# Altium schematic sheet ESP32.SchDoc
size 279 x 215 mm; SheetNumber: 2; SheetTotal: 4
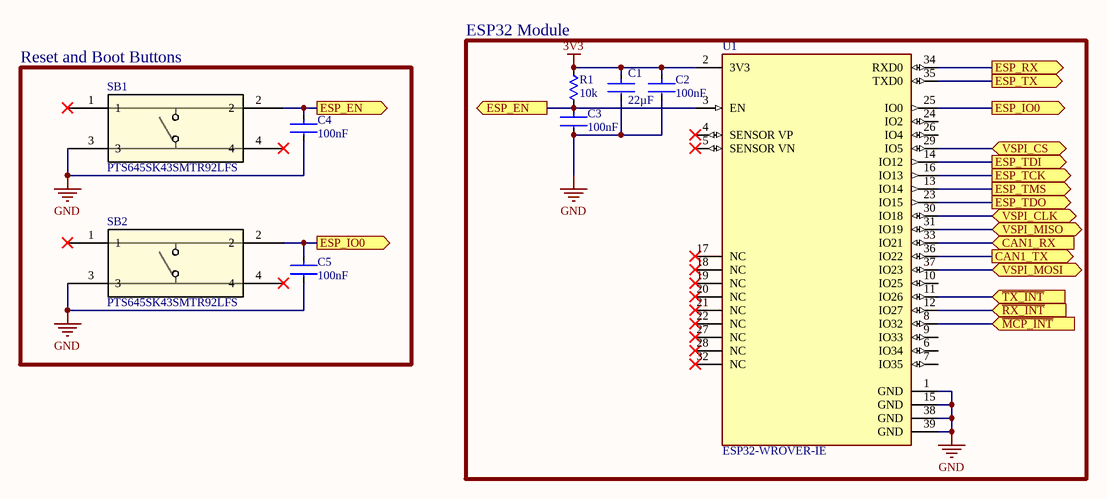
[diagram p0: ESP32.SchDoc]

## Parts
C1  value 22µF  [CL32A226KAJNNNE-Footprint-1]  (hidden comment: CL32A226KAJNNNE)
C2  value 100nF  [FP-CL10-IPC_B]  (hidden comment: CL10B104KB8WPNC)
C3  value 100nF  [FP-CL10-IPC_B]  (hidden comment: CL10B104KB8WPNC)
C4  value 100nF  [FP-CL10-IPC_B]  (hidden comment: CL10B104KB8WPNC)
C5  value 100nF  [FP-CL10-IPC_B]  (hidden comment: CL10B104KB8WPNC)
R1  value 10k  [FP-CRCW0603-e3-IPC_B]  (hidden comment: CRCW060310K0FKEA)
SB1  PTS645SK43SMTR92LFS  [PTS645SK43SMTR92LFS-Footprint-1]
SB2  PTS645SK43SMTR92LFS  [PTS645SK43SMTR92LFS-Footprint-1]
U1  ESP32-WROVER-IE  [FP-ESP32-WROVER-IE_M213EH-MFG]

## Blocks framed on the sheet
ESP32 Module: C1-C3 R1 U1
Reset and Boot Buttons: C4 C5 SB1 SB2

## Ports
CAN1_RX (in, see Telemetry_Module[4B], CAN_Controller[4A]), CAN1_TX (out, see Telemetry_Module[4B], CAN_Controller[4A]), ESP_EN (out, see Telemetry_Module[3C], FTDI_USB[5C]), ESP_IO0 (out, see Telemetry_Module[3C], FTDI_USB[5C]), ESP_RX (out, see Telemetry_Module[3B], FTDI_USB[4C]), ESP_TCK (out, see Telemetry_Module[3B], FTDI_USB[6D]), ESP_TDI (out, see Telemetry_Module[3B], FTDI_USB[6D]), ESP_TDO (out, see Telemetry_Module[3B], FTDI_USB[5D]), ESP_TMS (out, see Telemetry_Module[3B], FTDI_USB[5D]), ESP_TX (out, see Telemetry_Module[3B], FTDI_USB[4C]), VSPI_CLK (bidir, see Telemetry_Module[4C], CAN_Controller[5C]), VSPI_CS (bidir, see Telemetry_Module[4C], CAN_Controller[2C]), VSPI_MISO (bidir, see Telemetry_Module[4B], CAN_Controller[5C]), VSPI_MOSI (bidir, see Telemetry_Module[4B], CAN_Controller[5C]), ~{MCP_INT} (in, see Telemetry_Module[4C], CAN_Controller[2C]), ~{RX_INT} (in, see Telemetry_Module[4C], CAN_Controller[2C]), ~{TX_INT} (in, see Telemetry_Module[4C], CAN_Controller[2C])

## Nets
3V3: C1.1 C2.1 R1.2 U1.2(3V3)
GND: C1.2 C2.2 C3.2 C4.2 C5.2 SB1.3 SB2.3 U1.1(GND) U1.15(GND) U1.38(GND) U1.39(GND)
~{MCP_INT}: U1.8(IO32) ; port ~{MCP_INT}
~{RX_INT}: U1.12(IO27) ; port ~{RX_INT}
~{TX_INT}: U1.11(IO26) ; port ~{TX_INT}
CAN1_RX: U1.33(IO21) ; port CAN1_RX
CAN1_TX: U1.36(IO22) ; port CAN1_TX
ESP_EN: C3.1 C4.1 R1.1 SB1.2 U1.3(EN) ; port ESP_EN
ESP_IO0: C5.1 SB2.2 U1.25(IO0) ; port ESP_IO0
ESP_RX: U1.34(RXD0) ; port ESP_RX
ESP_TCK: U1.16(IO13) ; port ESP_TCK
ESP_TDI: U1.14(IO12) ; port ESP_TDI
ESP_TDO: U1.23(IO15) ; port ESP_TDO
ESP_TMS: U1.13(IO14) ; port ESP_TMS
ESP_TX: U1.35(TXD0) ; port ESP_TX
VSPI_CLK: U1.30(IO18) ; port VSPI_CLK
VSPI_CS: U1.29(IO5) ; port VSPI_CS
VSPI_MISO: U1.31(IO19) ; port VSPI_MISO
VSPI_MOSI: U1.37(IO23) ; port VSPI_MOSI

Not connected (* = marked no-connect by the designer): SB1 1* 4*; SB2 1* 4*; U1 4(SENSOR_VP)* 5(SENSOR_VN)* 6(IO34) 7(IO35) 9(IO33) 10(IO25) 17(NC)* 18(NC)* 19(NC)* 20(NC)* 21(NC)* 22(NC)* 24(IO2) 26(IO4) 27(NC)* 28(NC)* 32(NC)*

## Notes on the sheet
- Title
- Date
- Sheet
- of
- File
- Author

## Library data of the parts
C1 = CMP-001-00076-2: Ceramic Capacitor, Multilayer, Ceramic, 25V, 10% +Tol, 10% -Tol, X5R, 15% TC, 22uF, Surface Mount, 1210; Tolerance: 10%; RoHS Compliant: Yes; Min Operating Temperature: -55°C; Max Operating Temperature: 85°C; Pins: 2; Mounting Technology: Surface Mount; Capacitor Type: Ceramic; Case/Package: 1210
C2-C5 = CMP-001-00005-5: 0.1 µF ±10% 50V Ceramic Capacitor X7R 0603 (1608 Metric); Case/Package: 0603; Min Operating Temperature: -55°C; Mounting Technology: Surface Mount; Pins: 2; Max Operating Temperature: 125°C; Capacitor Type: Ceramic; Voltage Rating: 50V
R1 = CMP-009-00002-2: 10 kOhms ±1% 0.1W, 1/10W Chip Resistor 0603 (1608 Metric) Automotive AEC-Q200 Thick Film; Voltage Rating: 75V; Power: 100mW; Mounting Technology: Surface Mount; Max Operating Temperature: 155°C; Pins: 2; Min Operating Temperature: -55°C; Tolerance: 1%; Case/Package: 0603
SB1 SB2 = CMP-011-00006-1: Keypad Switch, 1 Switches, SPST, Momentary-tactile, 0.05A, 12VDC, 2.55N, 4 PCB Hole Cnt, Solder Terminal, Surface Mount-straight; Manufacturer Series: PTS645; Max Operating Temperature: 60°C; Min Operating Temperature: -20°C; Terminal Finish: Silver; Switch Action: MOMENTARY; RoHS Compliant: Yes; Mounting Technology: Surface Mount; Switch Function: SPST; Termination: Solder; Terminal Length: 0.138inch; Switch Type: Keypad
U1 = CMP-020-00002-1: Rx Txrx Mod Wifi Ext Ipex SMD